# Altium schematic sheet 02 LP_FMC.SchDoc
size A4
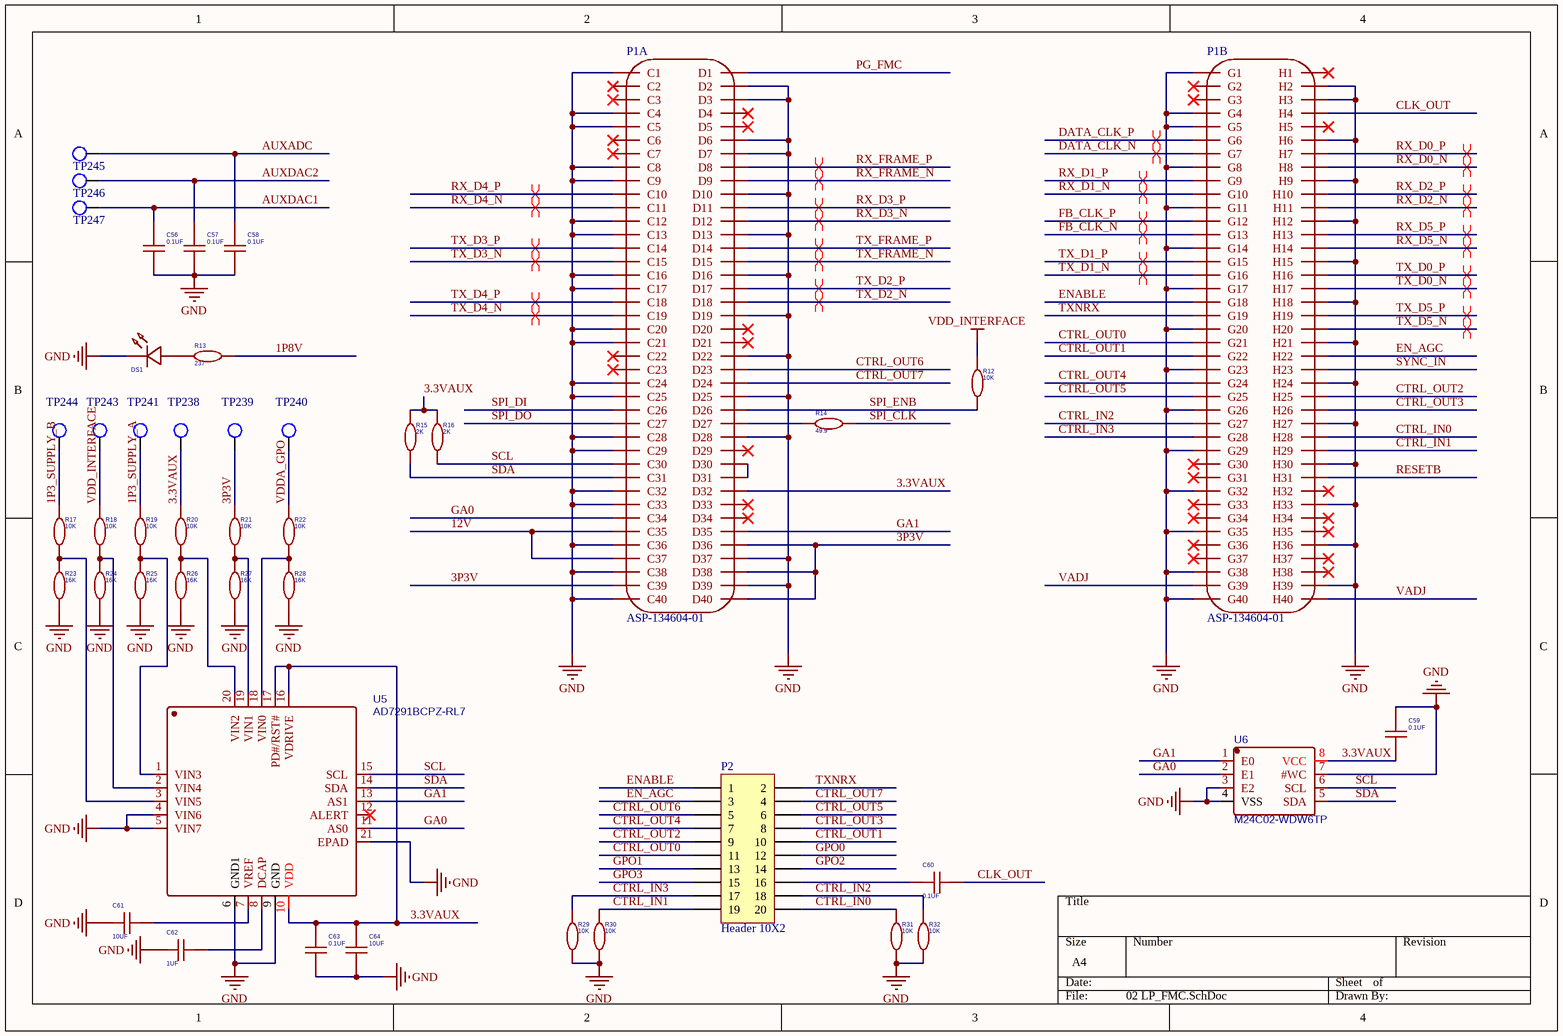
[diagram p0: 02 LP_FMC.SchDoc]

## Parts
C56  0.1UF  [C0201]
C57  0.1UF  [C0402]
C58  0.1UF  [C0201]
C59  0.1UF  [C0402]
C60  0.1UF  [C0402]
C61  10UF  [C0402]
C62  1UF  [C0402]
C63  0.1UF  [C0201]
C64  10UF  [C0402]
DS1  16-213SURC/S530-A3/TR8  [LED0805-RD]  (value not drawn)
P1  ASP-134604-01  [CNSAMTECASP-134604-01]  (parts A,B of 2)
P2  Header 10X2  [CNBERGF2X10H335LD32]
R12  10K  [C0201]
R13  237  [LC-0402_R]
R14  49.9  [C0201]
R15  2K  [C0201]
R16  2K  [C0201]
R17  10K  [C0201]
R18  10K  [C0201]
R19  10K  [C0201]
R20  10K  [C0201]
R21  10K  [C0201]
R22  10K  [C0201]
R23  16K  [C0201]
R24  16K  [C0201]
R25  16K  [C0201]
R26  16K  [C0201]
R27  16K  [C0201]
R28  16K  [C0201]
R29  10K  [C0201]
R30  10K  [C0201]
R31  10K  [C0201]
R32  10K  [C0201]
TP238  TEST POINT SURFACE  [TPC75D45]  (value not drawn)
TP239  TEST POINT SURFACE  [TPC75D45]  (value not drawn)
TP240  TEST POINT SURFACE  [TPC75D45]  (value not drawn)
TP241  TEST POINT SURFACE  [TPC75D45]  (value not drawn)
TP243  TEST POINT SURFACE  [TPC75D45]  (value not drawn)
TP244  TEST POINT SURFACE  [TPC75D45]  (value not drawn)
TP245  TEST POINT SURFACE  [TPC75D45]  (value not drawn)
TP246  TEST POINT SURFACE  [TPC75D45]  (value not drawn)
TP247  TEST POINT SURFACE  [TPC75D45]  (value not drawn)
U5  AD7291BCPZ-RL7  [LFCSP-20_L4.0-W4.0-P0.50-TL-EP2.7]
U6  M24C02-WDW6TP  [TSSOP8]

## Nets
GND: C56.2 C57.2 C58.2 C59.1 C61.1 C62.2 C63.2 C64.2 DS1.1(-) P1.C1 P1.C4 P1.C5 P1.C8 P1.C9 P1.C12 P1.C13 P1.C16 P1.C17 P1.C20 P1.C21 P1.C24 P1.C25 P1.C28 P1.C29 P1.C32 P1.C33 P1.C36 P1.C38 P1.C40 P1.D2 P1.D3 P1.D6 P1.D7 P1.D10 P1.D13 P1.D16 P1.D19 P1.D22 P1.D25 P1.D28 P1.D37 P1.D39 P1.G1 P1.G4 P1.G5 P1.G8 P1.G11 P1.G14 P1.G17 P1.G20 P1.G23 P1.G26 P1.G29 P1.G32 P1.G35 P1.G38 P1.G40 P1.H2 P1.H3 P1.H6 P1.H9 P1.H12 P1.H15 P1.H18 P1.H21 P1.H24 P1.H27 P1.H30 P1.H33 P1.H36 P1.H39 R23.2 R24.2 R25.2 R26.2 R27.2 R28.2 R29.1 R30.1 R31.1 R32.1 U5.4(VIN6) U5.5(VIN7) U5.6(GND1) U5.9(GND) U5.21(EPAD) U6.3(E2) U6.4(VSS) U6.7(#WC)
VDD_INTERFACE: R12.2 R18.1 TP243.1(TP)
1P3_SUPPLY_A: R19.1 TP241.1(TP)
1P3_SUPPLY_B: R17.1 TP244.1(TP)
1P8V: R13.2
3.3VAUX: C59.2 C63.1 C64.1 P1.D32 R15.2 R16.2 R20.1 TP238.1(TP) U5.10(VDD) U5.16(VDRIVE) U5.17(PD#/RST#) U6.8(VCC)
3P3V: P1.C39 P1.D36 P1.D38 P1.D40 R21.1 TP239.1(TP)
12V: P1.C35 P1.C37
AUXADC: C58.1 TP245.1(TP)
AUXDAC1: C56.1 TP247.1(TP)
AUXDAC2: C57.1 TP246.1(TP)
CLK_OUT: C60.2 P1.H4
CTRL_IN0: P1.H28 P2.20 R31.2
CTRL_IN1: P1.H29 P2.19 R30.2
CTRL_IN2: P1.G27 P2.18 R32.2
CTRL_IN3: P1.G28 P2.17 R29.2
CTRL_OUT0: P1.G21 P2.11
CTRL_OUT1: P1.G22 P2.10
CTRL_OUT2: P1.H25 P2.9
CTRL_OUT3: P1.H26 P2.8
CTRL_OUT4: P1.G24 P2.7
CTRL_OUT5: P1.G25 P2.6
CTRL_OUT6: P1.D23 P2.5
CTRL_OUT7: P1.D24 P2.4
DATA_CLK_N: P1.G7
DATA_CLK_P: P1.G6
EN_AGC: P1.H22 P2.3
ENABLE: P1.G18 P2.1
FB_CLK_N: P1.G13
FB_CLK_P: P1.G12
GA0: P1.C34 U5.11(AS0) U6.2(E1)
GA1: P1.D35 U5.13(AS1) U6.1(E0)
GPO0: P2.12
GPO1: P2.13
GPO2: P2.14
GPO3: P2.15
PG_FMC: P1.D1
RESETB: P1.H31
RX_D0_N: P1.H8
RX_D0_P: P1.H7
RX_D1_N: P1.G10
RX_D1_P: P1.G9
RX_D2_N: P1.H11
RX_D2_P: P1.H10
RX_D3_N: P1.D12
RX_D3_P: P1.D11
RX_D4_N: P1.C11
RX_D4_P: P1.C10
RX_D5_N: P1.H14
RX_D5_P: P1.H13
RX_FRAME_N: P1.D9
RX_FRAME_P: P1.D8
SCL: P1.C30 R16.1 U5.15(SCL) U6.6(SCL)
SDA: P1.C31 R15.1 U5.14(SDA) U6.5(SDA)
SPI_CLK: R14.2
SPI_DI: P1.C26
SPI_DO: P1.C27
SPI_ENB: P1.D26 R12.1
SYNC_IN: P1.H23
TX_D0_N: P1.H17
TX_D0_P: P1.H16
TX_D1_N: P1.G16
TX_D1_P: P1.G15
TX_D2_N: P1.D18
TX_D2_P: P1.D17
TX_D3_N: P1.C15
TX_D3_P: P1.C14
TX_D4_N: P1.C19
TX_D4_P: P1.C18
TX_D5_N: P1.H20
TX_D5_P: P1.H19
TX_FRAME_N: P1.D15
TX_FRAME_P: P1.D14
TXNRX: P1.G19 P2.2
VADJ: P1.G39 P1.H40
VDDA_GPO: R22.1 TP240.1(TP)
NetC60_1: C60.1 P2.16
NetC61_2: C61.2 U5.7(VREF)
NetC62_1: C62.1 U5.8(DCAP)
NetDS1_2: DS1.2(+) R13.1
NetP1_D27: P1.D27 R14.1
NetP1_D30: P1.D30 P1.D31
NetR17_2: R17.2 R23.1 U5.3(VIN5)
NetR18_2: R18.2 R24.1 U5.2(VIN4)
NetR19_2: R19.2 R25.1 U5.1(VIN3)
NetR20_2: R20.2 R26.1 U5.20(VIN2)
NetR21_2: R21.2 R27.1 U5.19(VIN1)
NetR22_2: R22.2 R28.1 U5.18(VIN0)

Not connected (* = marked no-connect by the designer): P1 C2* C3* C6* C7* C22* C23* D4* D5* D20* D21* D29* D33* D34* G2* G3* G30* G31* G33* G34* G36* G37* H1* H5* H32* H34* H35* H37* H38*; U5 12(ALERT)*

## Layout directives
differential pair: DATA_CLK_N, DATA_CLK_P, FB_CLK_N, FB_CLK_P, RX_D0_N, RX_D0_P, RX_D1_N, RX_D1_P, RX_D2_N, RX_D2_P, RX_D3_N, RX_D3_P, RX_D4_N, RX_D4_P, RX_D5_N, RX_D5_P, RX_FRAME_N, RX_FRAME_P, TX_D0_N, TX_D0_P, TX_D1_N, TX_D1_P, TX_D2_N, TX_D2_P, TX_D3_N, TX_D3_P, TX_D4_N, TX_D4_P, TX_D5_N, TX_D5_P, TX_FRAME_N, TX_FRAME_P

## Library data of the parts
C56-C60 C62 C63 = 0.1UF: BOM_Manufacturer: WTC; BOM_Manufacturer Part: 0402B104K160; nameAlias: Capacitance; BOM_Supplier: LCSC; BOM_Supplier Part: C83056; spicePre: C; spiceSymbolName: 0402B104K160
C61 C64 = 10UF: BOM_Manufacturer: WTC; BOM_Manufacturer Part: 0402B104K160; nameAlias: Capacitance; BOM_Supplier: LCSC; BOM_Supplier Part: C83056; spicePre: C; spiceSymbolName: 0402B104K160
DS1 = 16-213SURC/S530-A3/TR8: BOM_Manufacturer: Everlight Elec; Contributor: LCSC; BOM_Supplier: LCSC; BOM_Supplier Part: C605452; BOM_Manufacturer Part: 16-213SURC/S530-A3/TR8; spicePre: L; spiceSymbolName: 16-213SURC/S530-A3/TR8
P2 = Header 10X2: Header, 10-Pin, Dual row; LatestRevisionDate: 17-Jul-2002; LatestRevisionNote: Re-released for DXP Platform.; Publisher: Altium Limited
R12 R17-R32 = 10K: BOM_Manufacturer: YAGEO; BOM_Manufacturer Part: RC0402FR-0780R6L; nameAlias: Resistance (Ohms); Contributor: LCSC; BOM_Supplier: LCSC; BOM_Supplier Part: C185392; spicePre: R; spiceSymbolName: RC0402FR-0780R6L
R13 = 10R: BOM_Manufacturer: YAGEO; BOM_Manufacturer Part: RC0402FR-0780R6L; nameAlias: Resistance (Ohms); Contributor: LCSC; BOM_Supplier: LCSC; BOM_Supplier Part: C185392; spicePre: R; spiceSymbolName: RC0402FR-0780R6L
R14 = 39: BOM_Manufacturer: YAGEO; BOM_Manufacturer Part: RC0402FR-0780R6L; nameAlias: Resistance (Ohms); Contributor: LCSC; BOM_Supplier: LCSC; BOM_Supplier Part: C185392; spicePre: R; spiceSymbolName: RC0402FR-0780R6L
R15 R16 = 1K: BOM_Manufacturer: YAGEO; BOM_Manufacturer Part: RC0402FR-0780R6L; nameAlias: Resistance (Ohms); Contributor: LCSC; BOM_Supplier: LCSC; BOM_Supplier Part: C185392; spicePre: R; spiceSymbolName: RC0402FR-0780R6L
TP238-TP241 TP243-TP247 = TEST POINT SURFACE_1
U5 = AD7291BCPZ-RL7: BOM_Manufacturer: Analog Devices; Contributor: LCSC; BOM_Paste Type: expand; BOM_Supplier: LCSC; BOM_Supplier Part: C207434; BOM_Manufacturer Part: AD7291BCPZ-RL7; spicePre: U; spiceSymbolName: AD7291BCPZ-RL7
U6 = M24C02-WDW6TP: BOM_Manufacturer: STMicroelectronics; Contributor: LCSC; BOM_Paste Type: expand; BOM_Supplier: LCSC; BOM_Supplier Part: C283436; BOM_Manufacturer Part: M24C02-WDW6TP; spicePre: U; spiceSymbolName: M24C02-WDW6TP